# Altium schematic sheet 接口.SchDoc
size A4
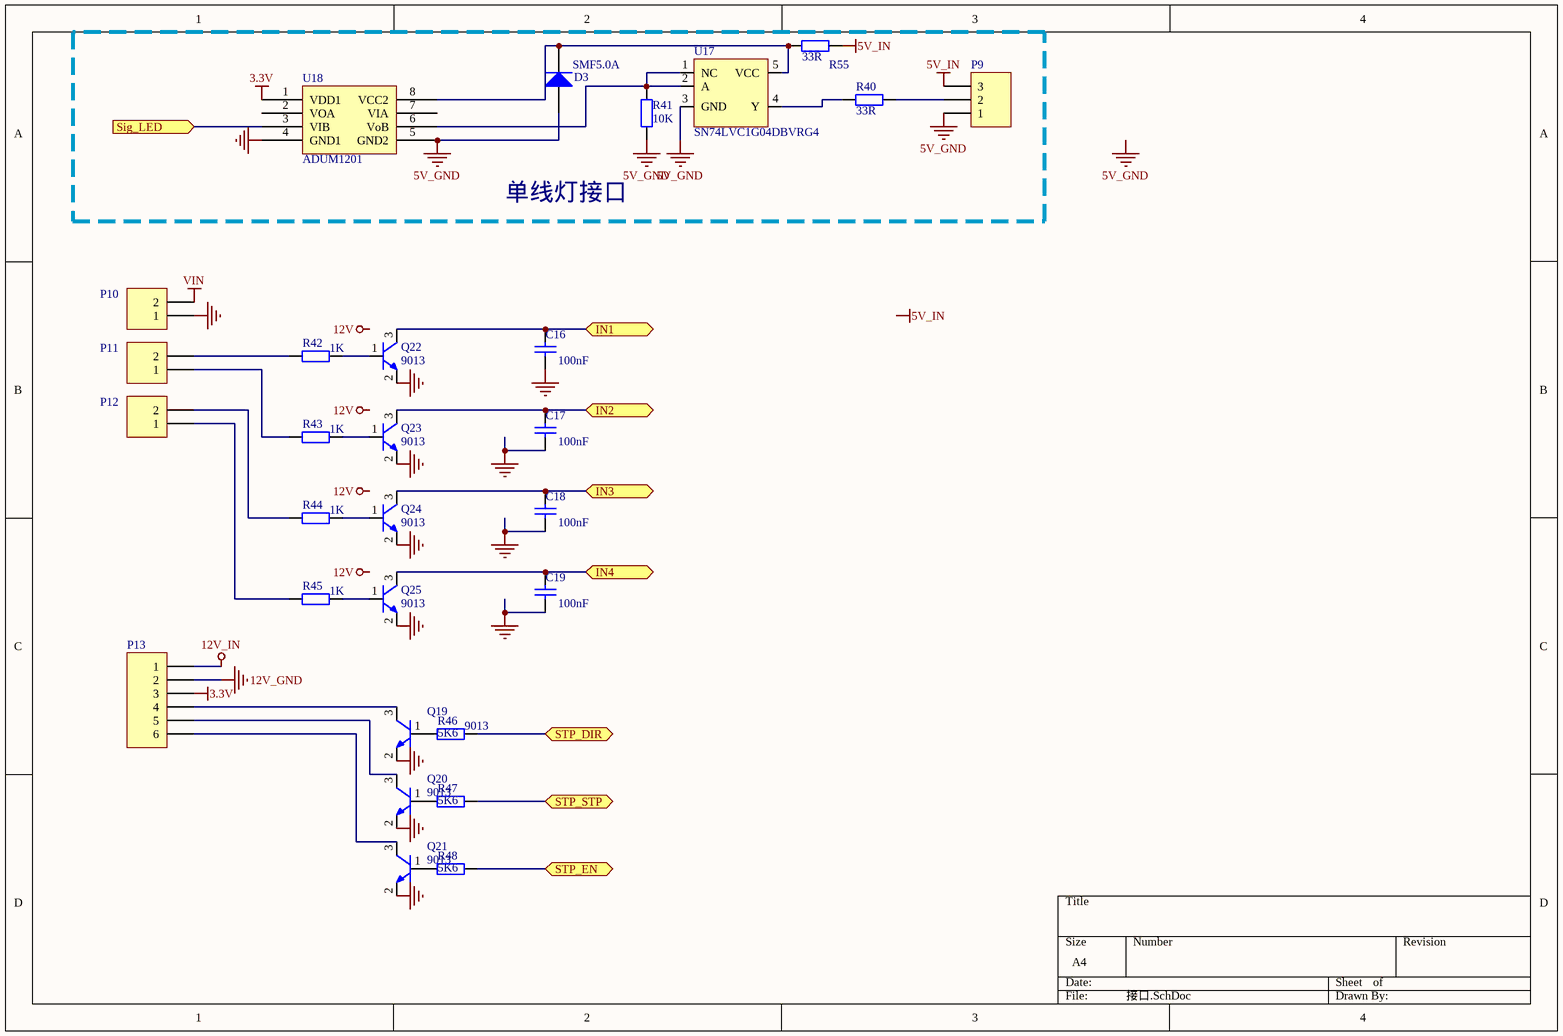
[diagram p0: 接口.SchDoc]

## Parts
C16  100nF  [1608C]
C17  100nF  [1608C]
C18  100nF  [1608C]
C19  100nF  [1608C]
D3  SMF5.0A  [SOD-123]
P9  (no value)  [KF2EDGV-3.81/3]
P10  (no value)  [KF128-3.81-2P]
P11  (no value)  [KF128-3.81-2P]
P12  (no value)  [KF128-3.81-2P]
P13  (no value)  [5264-6]
Q19  9013  [sot-23]
Q20  9013  [sot-23]
Q21  9013  [sot-23]
Q22  9013  [sot-23]
Q23  9013  [sot-23]
Q24  9013  [sot-23]
Q25  9013  [sot-23]
R40  33R  [1608]
R41  10K  [1608]
R42  1K  [1608]
R43  1K  [1608]
R44  1K  [1608]
R45  1K  [1608]
R46  5K6  [1608]
R47  5K6  [1608]
R48  5K6  [1608]
R55  33R  [1608]
U17  SN74LVC1G04DBVRG4  [SOT-23-5]
U18  ADUM1201  [so8]

## Blocks framed on the sheet
单线灯接口: D3 P9 R40 R41 R55 U17 U18

## Ports
IN1, IN2, IN3, IN4, Sig_LED (in), STP_DIR, STP_EN, STP_STP

## Nets
3.3V: P13.3 U18.1(VDD1)
5V_GND: D3.1(A) P9.1 R41.1 U17.3(GND) U18.5(GND2)
5V_IN: P9.3 R55.1
12V_GND: P13.2
12V_IN: P13.1
GND: C16.1 C17.1 C18.1 C19.1 P10.1 Q19.2(E) Q20.2(E) Q21.2(E) Q22.2(E) Q23.2(E) Q24.2(E) Q25.2(E) U18.4(GND1)
VIN: P10.2
IN1: C16.2 Q22.3(C) ; port IN1
IN2: C17.2 Q23.3(C) ; port IN2
IN3: C18.2 Q24.3(C) ; port IN3
IN4: C19.2 Q25.3(C) ; port IN4
Sig_LED: U18.3(VIB) ; port Sig_LED
STP_DIR: R46.1 ; port STP_DIR
STP_EN: R48.1 ; port STP_EN
STP_STP: R47.1 ; port STP_STP
NetD3_2: D3.2(K) R55.2 U17.5(VCC) U18.8(VCC2)
NetP9_2: P9.2 R40.1
NetP11_1: P11.1 R43.2
NetP11_2: P11.2 R42.2
NetP12_1: P12.1 R45.2
NetP12_2: P12.2 R44.2
NetP13_4: P13.4 Q19.3(C)
NetP13_5: P13.5 Q20.3(C)
NetP13_6: P13.6 Q21.3(C)
NetQ19_1: Q19.1(B) R46.2
NetQ20_1: Q20.1(B) R47.2
NetQ21_1: Q21.1(B) R48.2
NetQ22_1: Q22.1(B) R42.1
NetQ23_1: Q23.1(B) R43.1
NetQ24_1: Q24.1(B) R44.1
NetQ25_1: Q25.1(B) R45.1
NetR40_2: R40.2 U17.4(Y)
NetR41_2: R41.2 U17.1(NC) U17.2(A) U18.6(VoB)

Not connected (* = marked no-connect by the designer): U18 2(VOA) 7(VIA)

## Notes on the sheet
- Labels drawn without touching a wire or pin: 5V_GND, 5V_IN, 12V

## Library data of the parts
C16-C19 = Cap: Capacitor; Value: 0.1uF; Published: 8-Jun-2000; LatestRevisionDate: 17-Jul-2002; LatestRevisionNote: Re-released for DXP Platform.; PackageReference: RAD-0.3; Publisher: Altium Limited; PackageDescription: Radial Cap, Thru-Hole; 2 Leads; 0.3 in Pin Spacing
D3 = Diode: Default Diode; Published: 8-Jun-2000; LatestRevisionDate: 17-Jul-2002; LatestRevisionNote: Re-released for DXP Platform.; PackageDocument: Sep-1996; PackageReference: SMC; Publisher: Altium Limited; Code_JEDEC: DO-214-AB
P9 = Header 3: Header, 3-Pin; LatestRevisionDate: 17-Jul-2002; LatestRevisionNote: Re-released for DXP Platform.; Publisher: Altium Limited
P10-P12 = Header 2: Header, 2-Pin; LatestRevisionDate: 17-Jul-2002; LatestRevisionNote: Re-released for DXP Platform.; Publisher: Altium Limited
P13 = Header 6: Header, 6-Pin; LatestRevisionDate: 17-Jul-2002; LatestRevisionNote: Re-released for DXP Platform.; Publisher: Altium Limited
Q19-Q25 = NPNBT
R40 R41 R55 = Res2: Resistor; Value: 1K; Published: 8-Jun-2000; LatestRevisionDate: 17-Jul-2002; LatestRevisionNote: Re-released for DXP Platform.; PackageReference: 2012; Publisher: Altium Limited
R42-R45 = Res2: Resistor; Published: 8-Jun-2000; LatestRevisionDate: 17-Jul-2002; LatestRevisionNote: Re-released for DXP Platform.; PackageReference: 2012; Publisher: Altium Limited; Value: 1K
R46-R48 = Res2: Resistor; Value: 220R; Published: 8-Jun-2000; LatestRevisionDate: 17-Jul-2002; LatestRevisionNote: Re-released for DXP Platform.; PackageReference: AXIAL-0.4; Publisher: Altium Limited
U17 = LMV321
U18 = max485